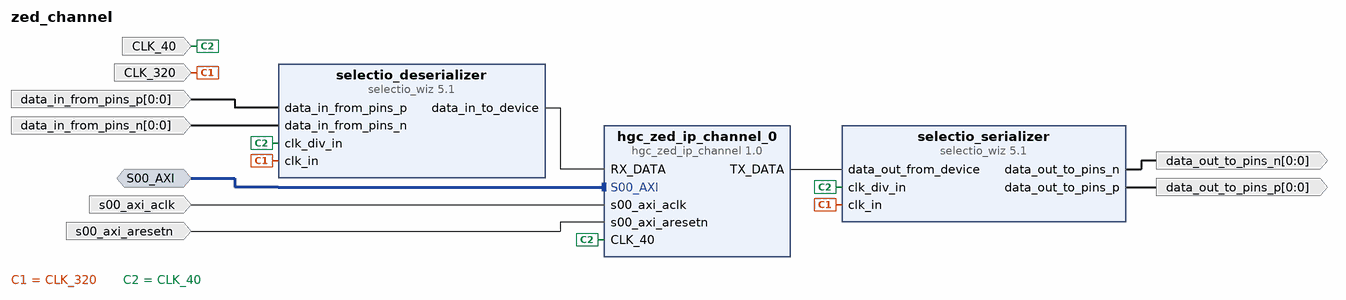
[diagram p0: block diagram of the top level]
# Vivado block design zed_channel, Vivado 2015.4
create_bd_design zed_channel

create_bd_intf_port -mode Slave -vlnv xilinx.com:interface:aximm_rtl:1.0 S00_AXI
set_property -dict [list \
  CONFIG.DATA_WIDTH 32 \
  CONFIG.PROTOCOL AXI4LITE \
  CONFIG.ID_WIDTH 0 \
  CONFIG.ADDR_WIDTH 32 \
  CONFIG.AWUSER_WIDTH 0 \
  CONFIG.ARUSER_WIDTH 0 \
  CONFIG.WUSER_WIDTH 0 \
  CONFIG.RUSER_WIDTH 0 \
  CONFIG.BUSER_WIDTH 0 \
  CONFIG.READ_WRITE_MODE READ_WRITE \
  CONFIG.HAS_BURST 1 \
  CONFIG.HAS_LOCK 1 \
  CONFIG.HAS_PROT 1 \
  CONFIG.HAS_CACHE 1 \
  CONFIG.HAS_QOS 1 \
  CONFIG.HAS_REGION 1 \
  CONFIG.HAS_WSTRB 1 \
  CONFIG.HAS_BRESP 1 \
  CONFIG.HAS_RRESP 1 \
  CONFIG.SUPPORTS_NARROW_BURST 0 \
  CONFIG.NUM_READ_OUTSTANDING 1 \
  CONFIG.NUM_WRITE_OUTSTANDING 1 \
  CONFIG.MAX_BURST_LENGTH 1 \
] [get_bd_intf_ports S00_AXI]
create_bd_port -dir I -type clk s00_axi_aclk
set_property -dict {CONFIG.FREQ_HZ 40000000} [get_bd_ports s00_axi_aclk]
create_bd_port -dir I -type rst s00_axi_aresetn
create_bd_port -dir I -from 0 -to 0 data_in_from_pins_p
create_bd_port -dir I -from 0 -to 0 data_in_from_pins_n
create_bd_port -dir I -type clk CLK_320
set_property -dict {CONFIG.FREQ_HZ 320000000} [get_bd_ports CLK_320]
create_bd_port -dir O -from 0 -to 0 data_out_to_pins_p
create_bd_port -dir O -from 0 -to 0 data_out_to_pins_n
create_bd_port -dir I -type clk CLK_40
set_property -dict {CONFIG.FREQ_HZ 40000000} [get_bd_ports CLK_40]

create_bd_cell -type ip -vlnv xilinx.com:ip:selectio_wiz:5.1 selectio_serializer
set_property -dict [list \
  CONFIG.BUS_DIR OUTPUTS \
  CONFIG.BUS_SIG_TYPE DIFF \
  CONFIG.BUS_IO_STD LVDS_25 \
  CONFIG.USE_SERIALIZATION true \
  CONFIG.SERIALIZATION_FACTOR 8 \
  CONFIG.SELIO_CLK_BUF MMCM \
] [get_bd_cells selectio_serializer]
create_bd_cell -type ip -vlnv xilinx.com:ip:selectio_wiz:5.1 selectio_deserializer
set_property -dict [list \
  CONFIG.BUS_SIG_TYPE DIFF \
  CONFIG.BUS_IO_STD LVDS_25 \
  CONFIG.USE_SERIALIZATION true \
  CONFIG.SERIALIZATION_FACTOR 8 \
  CONFIG.SELIO_BUS_IN_DELAY NONE \
  CONFIG.SELIO_CLK_BUF MMCM \
] [get_bd_cells selectio_deserializer]
create_bd_cell -type ip -vlnv fnal.gov:user:hgc_zed_ip_channel:1.0 hgc_zed_ip_channel_0

# ---- connections ----

connect_bd_intf_net [get_bd_intf_ports S00_AXI] [get_bd_intf_pins hgc_zed_ip_channel_0/S00_AXI]
connect_bd_net [get_bd_pins selectio_deserializer/data_in_to_device] [get_bd_pins hgc_zed_ip_channel_0/RX_DATA]
connect_bd_net [get_bd_ports s00_axi_aclk] [get_bd_pins hgc_zed_ip_channel_0/s00_axi_aclk]
connect_bd_net [get_bd_ports s00_axi_aresetn] [get_bd_pins hgc_zed_ip_channel_0/s00_axi_aresetn]
connect_bd_net [get_bd_ports data_in_from_pins_p] [get_bd_pins selectio_deserializer/data_in_from_pins_p]
connect_bd_net [get_bd_ports data_in_from_pins_n] [get_bd_pins selectio_deserializer/data_in_from_pins_n]
connect_bd_net -net CLK_320_1 [get_bd_ports CLK_320] [get_bd_pins selectio_deserializer/clk_in] [get_bd_pins selectio_serializer/clk_in]
connect_bd_net [get_bd_pins hgc_zed_ip_channel_0/TX_DATA] [get_bd_pins selectio_serializer/data_out_from_device]
connect_bd_net [get_bd_pins selectio_serializer/data_out_to_pins_p] [get_bd_ports data_out_to_pins_p]
connect_bd_net [get_bd_pins selectio_serializer/data_out_to_pins_n] [get_bd_ports data_out_to_pins_n]
connect_bd_net -net CLK_40_1 [get_bd_ports CLK_40] \
  [get_bd_pins selectio_deserializer/clk_div_in] [get_bd_pins selectio_serializer/clk_div_in] \
  [get_bd_pins hgc_zed_ip_channel_0/CLK_40]

# ---- address map ----
assign_bd_address -offset 0x44A00000 -range 64K -target_address_space [get_bd_addr_spaces S00_AXI] [get_bd_addr_segs hgc_zed_ip_channel_0/S00_AXI/S00_AXI_reg]

validate_bd_design
save_bd_design
